# EAGLE design ClapSwitch (EAGLE 8.3.2)
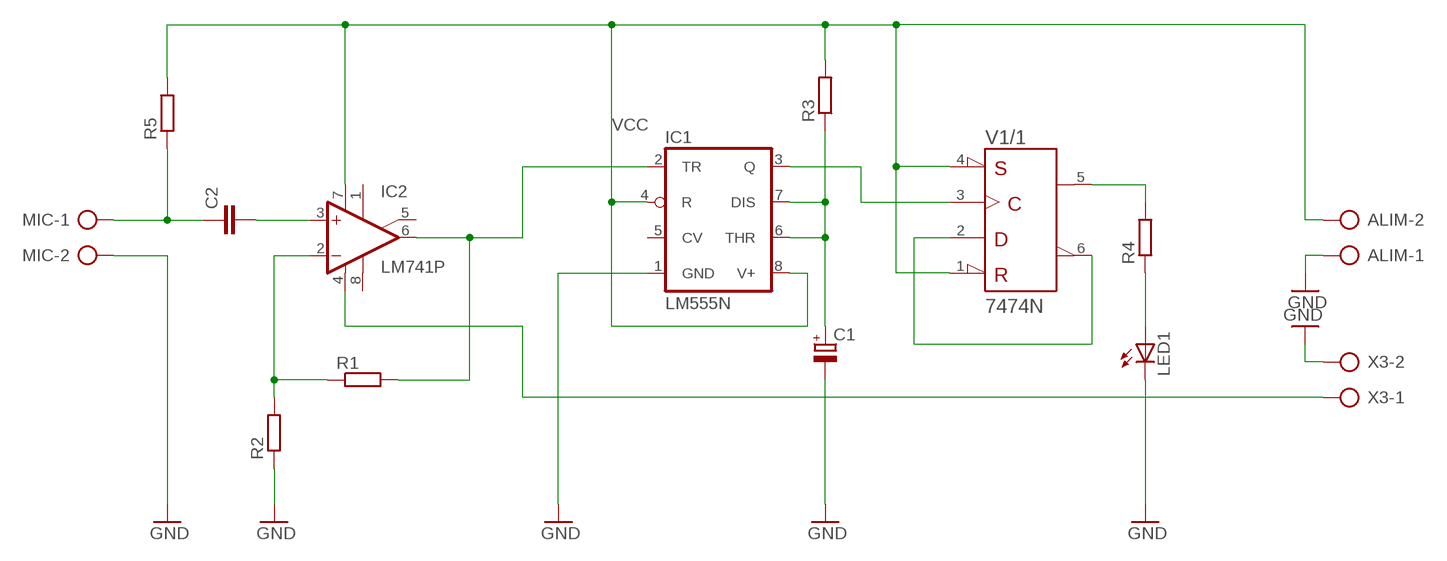
[diagram p0: schematic, sheet 1]

## Parts
ALIM  AK300/2  [AK300/2]
C1  CPOL-EUE5-8.5  [E5-8,5]
C2  C-EU050-030X075  [C050-030X075]
IC1  LM555N  [DIL08]
IC2  LM741P  [DIL08]
LED1  LEDLZR181  [LZR181]
MIC  AK300/2  [AK300/2]
R1  R-EU_0204/7  [0204/7]
R2  R-EU_0204/7  [0204/7]
R3  R-EU_0204/7  [0204/7]
R4  R-EU_0204/7  [0204/7]
R5  R-EU_0204/7  [0204/7]
V1  7474N  [DIL14]
X3  AK300/2  [AK300/2]

## Nets
GND: ALIM.1 C1.- IC1.1(GND) LED1.K(C) MIC.2 R2.1 X3.2
N$1: IC1.3(Q) V1.3(/1:CLK)
N$2: IC2.4(V-) X3.1
N$3: V1.2(/1:D) V1.6(/1:!Q)
N$4: R4.2 V1.5(/1:Q)
N$5: C1.+ IC1.6(THR) IC1.7(DIS) R3.1
N$6: LED1.A R4.1
N$7: C2.1 MIC.1 R5.1
N$8: IC1.2(TR) IC2.6(OUT) R1.2
N$9: IC2.2(-IN) R1.1 R2.2
N$10: C2.2 IC2.3(+IN)
VCC: ALIM.2 IC1.4(R) IC1.8(V+) IC2.7(V+) R3.2 R5.2 V1.1(/1:!CLR) V1.4(/1:!PRE)
Unconnected: IC1.5(CV) IC2.1(ON1) IC2.5(ON2) IC2.8(OPT) V1.8(/2:!Q) V1.9(/2:Q) V1.10(/2:!PRE) V1.11(/2:CLK) V1.12(/2:D) V1.13(/2:!CLR)

## Power pins joined to a net without a drawn wire
+UB: V1.14(/+UB:+UB)
-UB: V1.7(/-UB:-UB)

## Library data of the parts
ALIM MIC X3 = con-ptr500:AK300/2: CONNECTOR; OC_FARNELL: unknown; OC_NEWARK: unknown
C1 = rcl:CPOL-EU: POLARIZED CAPACITOR, European symbol
C2 = rcl:C-EU: CAPACITOR, European symbol
IC1 = linear:*555: TIMER
IC2 = linear:*741: OP AMP
LED1 = led:LED: LED OSRAM: - CHIPLED LG R971, LG N971, LY N971, LG Q971, LY Q971, LO R971, LY R971 LH N974, LH R974 LS Q976, LO Q976, LY Q976 LO Q996 - Hyper CHIPLED LW Q18S LB Q993, LB Q99A, LB R99A - SideLED LS A670, LO A670, LY A670, LG A670, LP A670 LB A673, LV A673, LT A673, LW A673 LH A674 LY A675 LS A676, LA A676, LO A676, LY A676, LW A676 LS A679, LY A679, LG A679 - Hyper Micro SIDELED® LS Y876, LA Y876, LO Y876, LY Y876 LT Y87S - SmartLED LW L88C, LW L88S LB L89C, LB L89S, LG L890 LS L89K, LO L89K, LY L89K LS L896, LA L896, LO L896, LY L896 - TOPLED LS T670, LO T670, LY T670, LG T670, LP T670 LSG T670, LSP T670, LSY T670, LOP T670, LYG T670 LG T671, LOG T671, LSG T671 LB T673, LV T673, LT T673, LW T673 LH T674 LS T676, LA T676, LO T676, LY T676, LB T676, LH T676, LSB T676, LW T676 LB T67C, LV T67C, LT T67C, LS T67K, LO T67K, LY T67K, LW E67C LS E67B, LA E67B, LO E67B, LY E67B, LB E67C, LV E67C, LT E67C LW T67C LS T679, LY T679, LG T679 LS T770, LO T770, LY T770, LG T770, LP T770 LB T773, LV T773, LT T773, LW T773 LH T774 LS E675, LA E675, LY E675, LS T675 LS T776, LA T776, LO T776, LY T776, LB T776 LHGB T686 LT T68C, LB T68C - Hyper Mini TOPLED® LB M676 - Mini TOPLED Santana® LG M470 LS M47K, LO M47K, LY M47K Source: http://www.osram.convergy.de LUXEON: - LUMILED® LXK2-PW12-R00, LXK2-PW12-S00, LXK2-PW14-U00, LXK2-PW14-V00 LXK2-PM12-R00, LXK2-PM12-S00, LXK2-PM14-U00 LXK2-PE12-Q00, LXK2-PE12-R00, LXK2-PE12-S00, LXK2-PE14-T00, LXK2-PE14-U00 LXK2-PB12-K00, LXK2-PB12-L00, LXK2-PB12-M00, LXK2-PB14-N00, LXK2-PB14-P00, LXK2-PB14-Q00 LXK2-PR12-L00, LXK2-PR12-M00, LXK2-PR14-Q00, LXK2-PR14-R00 LXK2-PD12-Q00, LXK2-PD12-R00, LXK2-PD12-S00 LXK2-PH12-R00, LXK2-PH12-S00 LXK2-PL12-P00, LXK2-PL12-Q00, LXK2-PL12-R00 Source: www.luxeon.com KINGBRIGHT: KA-3528ASYC Source: www.kingbright.com
R1-R5 = rcl:R-EU_: RESISTOR, European symbol
V1 = 74ttl-din:74*74: Dual D type positive edge triggered FLIP FLOP, preset and clear

## Board
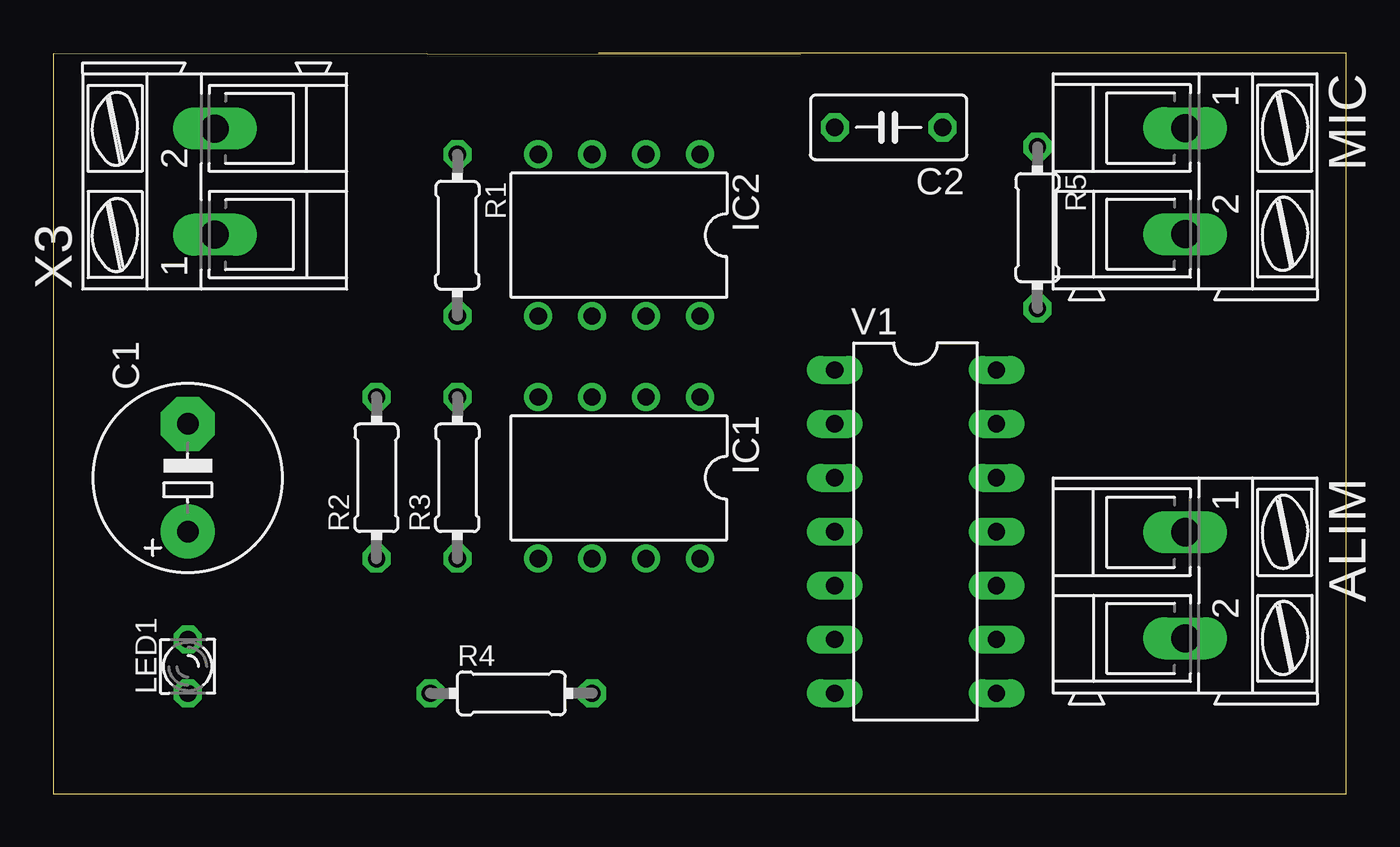
[diagram p1: board, top side]
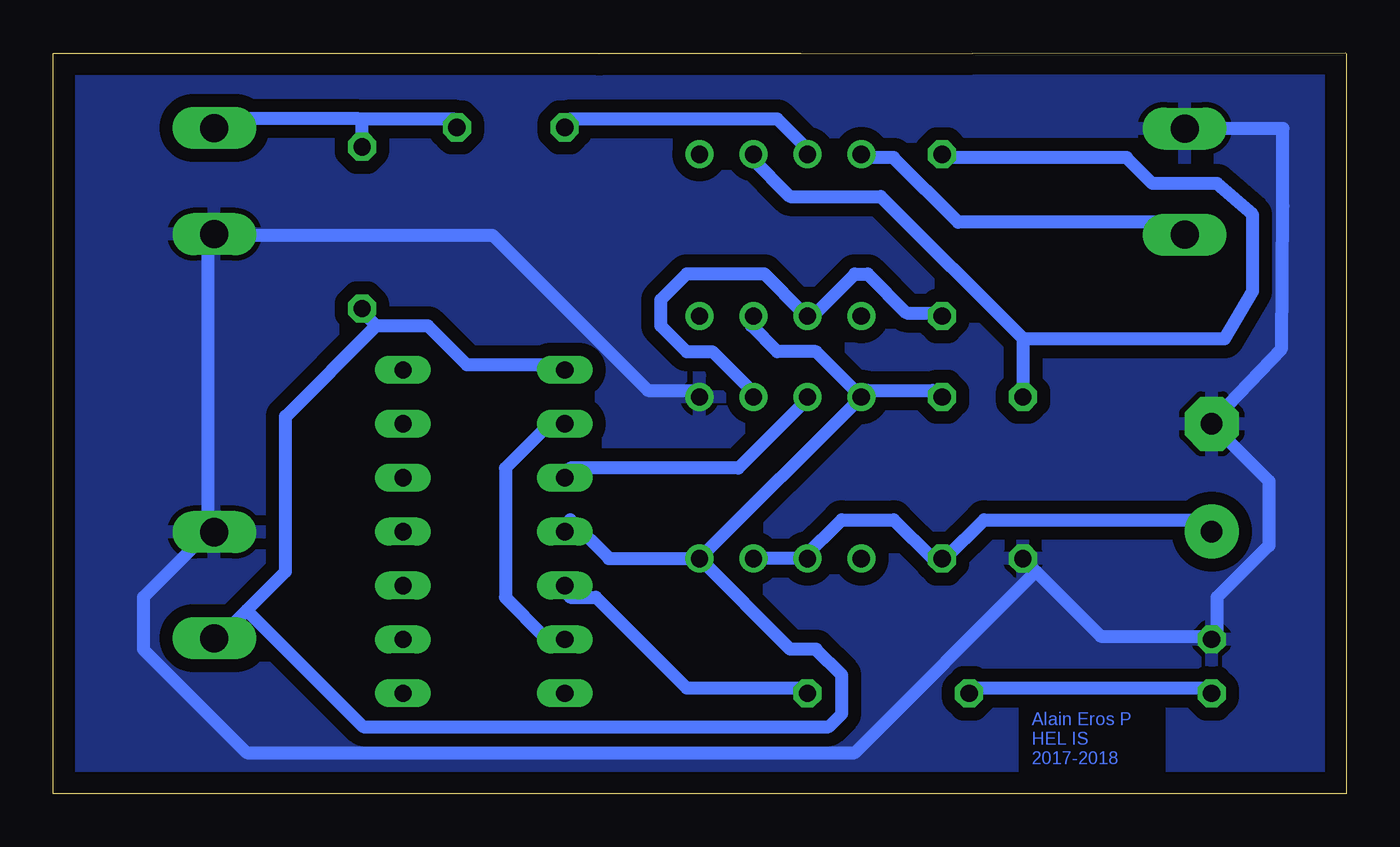
[diagram p2: board, bottom side, seen from below]

Size 60.94 x 34.9 mm. Coordinates in mm from the lower left corner, seen from the top.
Outline: 60.94,34.87 60.94,0 0,0 0,34.87
Outline: 0.03,34.9 35.2,34.85
Outline: 60.94,34.9 25.7,34.9
Copper layers (1*16): Top 0.035mm / dielectric 1.5mm / Bottom 0.035mm
Design rules "default *": minimum track width 24mil, minimum drill 0.35mm, track to track 24mil, track to pad 24mil, pad to pad 24mil, via to via 24mil, smd to smd 24mil, copper to edge 40mil, drill to drill 6mil, minimum pad ring 10mil, minimum via ring 8mil, stop-mask expansion 4mil, vias tented up to drill 0mil, thermal gap 10mil

### Footprints (pad centres in the part's own frame; a part is rotated, then mirrored left to right if it is on the bottom)
AK300/2 = drill 1.321 long: 1 -2.515,0; 2 2.489,0
E5-8,5 = drill 1.016 pad 2.54: + -2.54,0 | drill 1.016 pad 2.54 octagon: - 2.54,0
C050-030X075 = drill 0.813 octagon: 1 -2.54,0; 2 2.54,0
DIL08 = drill 0.813 pad 1.27: 1 -3.81,-3.81; 2 -1.27,-3.81; 3 1.27,-3.81; 4 3.81,-3.81; 5 3.81,3.81; 6 1.27,3.81; 7 -1.27,3.81; 8 -3.81,3.81
LZR181 = drill 0.813 octagon: A -1.27,0; K 1.27,0
0204/7 = drill 0.813 octagon: 1 -3.81,0; 2 3.81,0
DIL14 = drill 0.813 long: 1 -7.62,-3.81; 2 -5.08,-3.81; 3 -2.54,-3.81; 4 0,-3.81; 5 2.54,-3.81; 6 5.08,-3.81; 7 7.62,-3.81; 8 7.62,3.81; 9 5.08,3.81; 10 2.54,3.81; 11 0,3.81; 12 -2.54,3.81; 13 -5.08,3.81; 14 -7.62,3.81

### Placement (x,y rotation side)
ALIM  53.34,9.8 270 top
C1  6.35,14.88 90 top
C2  39.37,31.39 180 top
IC1  26.67,14.88 180 top
IC2  26.67,26.31 180 top
LED1  6.35,5.99 90 top
MIC  53.34,28.85 270 top
R1  19.05,26.31 270 top
R2  15.24,14.88 90 top
R3  19.05,14.88 90 top
R4  21.59,4.72 0 top
R5  46.38,26.67 270 top
V1  40.64,12.34 270 top
X3  7.62,28.85 90 top

### Tracks (layer width: path | path; a pad name or v marks a point on that pad's centre or on a via)
GND
  Bottom 0.61: R2.1 14.63,10.46 | 14.63,10.46 11.58,7.42 6.71,7.42 LED1.K 6.1,7.42 6.1,9.25 3.66,11.68 3.66,14.73 C1.- 6.1,17.78 3.05,20.98 3,27.69 3,31.34 X3.2 | IC1.1 30.48,19 32.92,19 40.23,26.31 53.03,26.31 MIC.2 53.65,26.31 53.65,12.9 ALIM.1 53.65,12.29 56.69,9.25 56.69,6.81 51.82,1.93 23.16,1.93 14.63,10.46
  pour Bottom: 1.27,34.14 1.27,0.41 59.64,0.41 59.64,34.14
N$1
  Bottom 0.61: V1.3 36.58,15.34 28.65,15.34 25.6,18.39 IC1.3
N$2
  Bottom 0.61: IC2.4 22.55,29.97 21.34,29.97 18.29,26.92 7.92,26.92 X3.1
N$3
  Bottom 0.61: V1.6 37.19,7.42 37.8,7.42 39.62,9.25 39.62,15.34 37.19,17.78 V1.2
N$4
  Bottom 0.61: R4.2 25.6,4.98 31.09,4.98 35.36,9.25 36.58,9.25 V1.5
N$5
  Bottom 0.61: 25.6,11.07 23.77,12.9 21.34,12.9 19.51,11.07 R3.1 18.9,11.07 17.07,12.9 6.71,12.9 C1.+ | 25.6,11.07 IC1.7 | 25.6,11.07 IC1.6
N$6
  Bottom 0.61: LED1.A 6.71,4.98 17.68,4.98 R4.1
N$7
  Bottom 0.61: 46.53,31.8 53.03,31.8 MIC.1 | 46.53,31.8 42.06,31.8 C2.1 | R5.1 46.38,31.65 46.53,31.8
N$8
  Bottom 0.61: R1.2 19.51,22.66 20.73,22.66 22.55,24.49 23.16,24.49 24.99,22.66 IC2.6 25.6,22.66 27.43,24.49 31.09,24.49 32.31,23.27 32.31,22.05 31.09,20.83 29.87,20.83 28.04,19 IC1.2
N$9
  Bottom 0.61: 15.24,21.44 R2.2 | 15.24,21.44 21.95,28.14 26.21,28.14 28.04,29.97 IC2.2 | 15.24,21.44 5.74,21.44 4.42,23.67 4.42,27.28 6.1,28.75 9.14,28.75 10.36,29.97 18.9,29.97 R1.1
N$10
  Bottom 0.61: IC2.3 25.6,30.58 26.82,31.8 36.58,31.8 C2.2
VCC
  Bottom 0.61: IC1.8 34.75,11.07 36.58,12.9 V1.4 | R3.2 19.51,19 22.55,19 IC1.4 | IC1.4 24.99,20.83 26.82,20.83 28.04,22.05 IC2.7 | IC1.4 IC1.8 | 45.72,22.05 43.28,22.05 41.45,20.22 37.19,20.22 V1.1 | 45.72,22.05 49.99,17.78 49.99,10.46 51.82,8.64 | 51.82,8.64 53.03,7.42 ALIM.2 | IC1.8 26.21,6.81 24.99,6.81 23.77,5.59 23.77,3.76 24.38,3.15 46.33,3.15 51.82,8.64 | R5.2 46.38,22.71 45.72,22.05

### Text on the board
Bottom: Alain Eros P / HEL IS / 2017-2018